# Altium schematic sheet SH3-FTDI.SchDoc: SH3_FTDI
size Letter; DrawnBy: Christopher Arjune; SheetNumber: 3; SheetTotal: 4
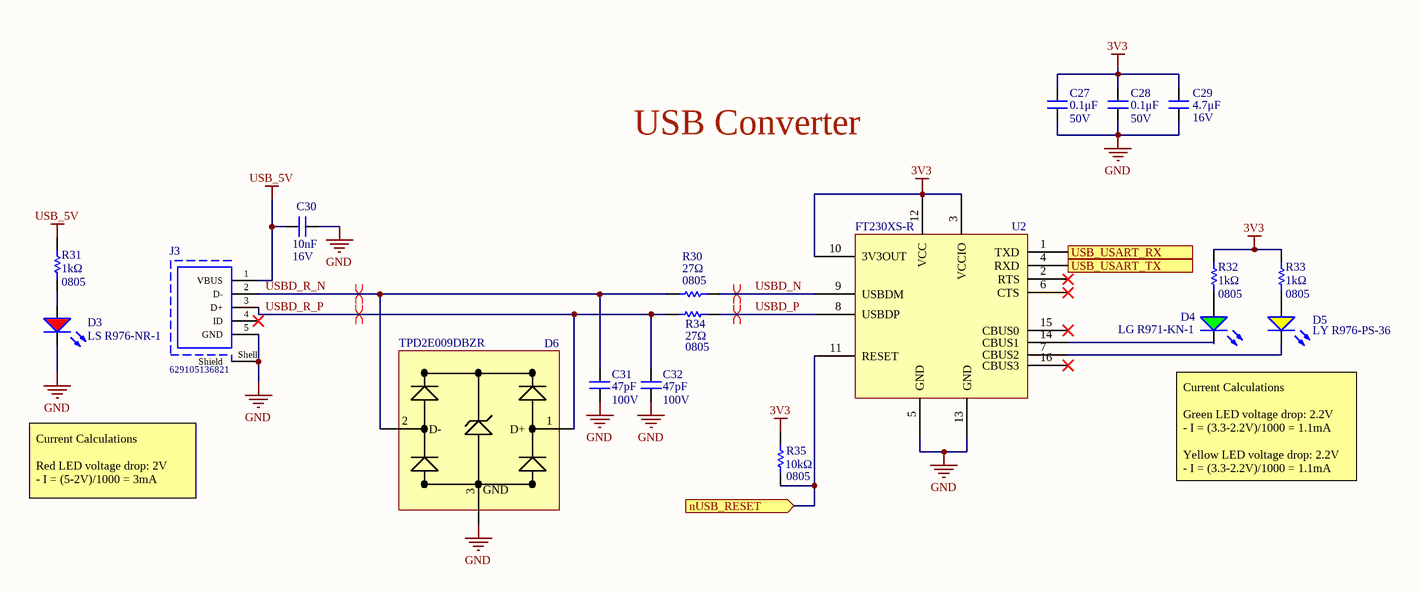
[diagram p0: SH3-FTDI.SchDoc]

## Parts
C27  0.1μF  Voltage Rating: 50V  [CAPC2012X140N]
C28  0.1μF  Voltage Rating: 50V  [CAPC2012X140N]
C29  value 4.7μF  Voltage Rating: 16V  [CAPC2012X140N]
C30  Capacitance: 10nF  Voltage Rating: 16V  [CAPC2012X140N]
C31  Capacitance: 47pF  Voltage Rating: 100V  [CAPC2012X140N]
C32  Capacitance: 47pF  Voltage Rating: 100V  [CAPC2012X140N]
D3  LS R976-NR-1  [LED_0805_LINE]
D4  LG R971-KN-1  [LED_0805_LINE]
D5  LY R976-PS-36  [LED_0805_LINE]
D6  Manufacturer Part Number: TPD2E009DBZR  [SOT23-3]  (hidden comment: TVS_DIODE_USB_5.5V)
J3  629105136821  [629105136821]
R30  Case/Package: 0805  Resistance: 27Ω  [RESC2012X60N]  (hidden comment: RES_27Ω_0805)
R31  1kΩ  Case Code (Imperial): 0805  [RESC2012X60N]
R32  1kΩ  Case Code (Imperial): 0805  [RESC2012X60N]
R33  1kΩ  Case Code (Imperial): 0805  [RESC2012X60N]
R34  Case/Package: 0805  Resistance: 27Ω  [RESC2012X60N]  (hidden comment: RES_27Ω_0805)
R35  value 10kΩ  Case Code (Imperial): 0805  [RESC2012X60N]  (hidden comment: RES_10kΩ_0805)
U2  Manufacturer Part Number 1: FT230XS-R  [SSOP16-0.635-5X4MM]  (hidden comment: IC_USB_TRANSCEIVER)

## Ports
nUSB_RESET (in), USB_USART_RX (out), USB_USART_TX (in)

## Nets
3V3: C27.2 C28.2 C29.2 R32.2 R33.2 R35.2 U2.3(VCCIO) U2.10(3V3OUT) U2.12(VCC)
GND: C27.1 C28.1 C29.1 C30.2 C31.2 C32.2 D3.2(K) D6.3(GND) J3.5(GND) J3.Shell(Shield) U2.5(GND) U2.13(GND)
USB_5V: C30.1 J3.1(VBUS) R31.2
nUSB_RESET: R35.1 U2.11(RESET) ; port nUSB_RESET
USB_USART_RX: U2.1(TXD) ; port USB_USART_RX
USB_USART_TX: U2.4(RXD) ; port USB_USART_TX
USBD_N: R30.2 U2.9(USBDM)
USBD_P: R34.2 U2.8(USBDP)
USBD_R_N: C31.1 D6.2(D-) J3.2(D-) R30.1
USBD_R_P: C32.1 D6.1(D+) J3.3(D+) R34.1
NetD3_1: D3.1(A) R31.1
NetD4_1: D4.1(A) R32.1
NetD4_2: D4.2(K) U2.14(CBUS1)
NetD5_1: D5.1(A) R33.1
NetD5_2: D5.2(K) U2.7(CBUS2)

Not connected (* = marked no-connect by the designer): J3 4(ID)*; U2 2(RTS)* 6(CTS)* 15(CBUS0)* 16(CBUS3)*

## Layout directives
differential pair: USBD_N, USBD_P, USBD_R_N, USBD_R_P

## Notes on the sheet
- USB Converter
- Current Calculations
  Red LED voltage drop: 2V
  - I = (5-2V)/1000 = 3mA
- Current Calculations
  Green LED voltage drop: 2.2V
  - I = (3.3-2.2V)/1000 = 1.1mA
  Yellow LED voltage drop: 2.2V
  - I = (3.3-2.2V)/1000 = 1.1mA
- Title
- Size:
- Date:
- Letter
- Drawn By:
- Sheet
- of
- File:

## Library data of the parts
C27 C28 = CAP_0.1uF_50V_0805: CAP CER 0.1UF 50V X7R 0805; Manufacturer 1: Murata Electronics; Manufacturer Part Number 1: GCD21BR71H104KA01L; Tolerance: 10%; Mount: Surface Mount; Case Code (Metric): 2012; Case Code (Imperial): 0805; Min Operating Temperature: -55°C; Max Operating Temperature: 125°C; Dielectric: X7R; Termination: SMD/SMT; Length: 2mm; Height: 1.25mm; Width: 0.049inch; Thickness: 0.049inch; Depth: 1.25mm; Ratings: AEC-Q200; Supplier 1: Digi-Key; Supplier Part Number 1: 490-11955-1-ND; Package: 0805 (2012 Metric); Value: 0.1μF
C29 = CAP_4.7uF_16V_0805: CAP CER 4.7UF 16V X5R 0805; Manufacturer 1: Samsung Electro-Mechanics; Manufacturer Part Number 1: CL21A475KOFNNNE; Tolerance: 10%; Mount: Surface Mount; Case Code (Metric): 2012; Case Code (Imperial): 0805; Min Operating Temperature: -55°C; Max Operating Temperature: 85°C; Dielectric: X5R; Termination: SMD/SMT; Supplier 1: Digi-Key; Supplier Part Number 1: 1276-1065-1-ND; Package: 0805 (2012 Metric)
C30 = CAP_10nF_16V_0805: CAP CER 10000PF 16V X7R 0805; Manufacturer 1: Yageo; Manufacturer Part Number 1: AC0805KRX7R7BB103; Tolerance: 10%; Supplier 1: Digi-Key; Stock 1: 14344; Pricing 1: 1=0.20000, 10=0.13900, 100=0.07060, 500=0.04832, 1000=0.04275 (USD); RoHS: No; Mount: Surface Mount; Case/Package: 0805; Case Code (Imperial): 0805; Case Code (Metric): 2012; Min Operating Temperature: -55°C; Max Operating Temperature: 125°C; Packaging: Cut Tape; Ratings: AEC-Q200; ComponentLink1URL: http://www.yageo.com/NewPortal/_en/search/productDocs.jsp?YageoPartNumber=AC0805KRX7R7BB103&src-supplier=Digi-Key; ComponentLink1Description: http://www.yageo.com/NewPortal/_en/search/productDocs.jsp?YageoPartNumber=AC0805KRX7R7BB103&src-supplier=Digi-Key; Supplier Part Number 1: 311-3161-1-ND
C31 C32 = CAP_47pF_100V_0805: CAP CER 47PF 100V NPO 0805; Manufacturer 1: Yageo; Manufacturer Part Number 1: AC0805JRNPO0BN470; Tolerance: 5%; Supplier 1: Digi-Key; Stock 1: 2091; Pricing 1: 1=0.19000, 10=0.12600, 100=0.06400, 500=0.04376, 1000=0.03871 (USD); RoHS: No; Mount: Surface Mount; Case/Package: 0805; Case Code (Imperial): 0805; Case Code (Metric): 2012; Min Operating Temperature: -55°C; Max Operating Temperature: 125°C; Packaging: Tape and Reel; Ratings: AEC-Q200; ComponentLink1URL: http://www.yageo.com/NewPortal/_en/search/productDocs.jsp?YageoPartNumber=AC0805JRNPO0BN470&src-supplier=Digi-Key; ComponentLink1Description: http://www.yageo.com/NewPortal/_en/search/productDocs.jsp?YageoPartNumber=AC0805JRNPO0BN470&src-supplier=Digi-Key; Supplier Part Number 1: 311-3131-1-ND
D3 = DIO_LED_R: LED RED DIFFUSED 0805 SMD; Manufacturer 1: OSRAM; Forward Voltage Drop: 2V; Package: 0805 (2012 Metric); Manufacturer Part Number 1: LS R976-NR-1; Supplier Part Number 1: 475-1278-1-ND; Supplier 1: Digi-Key; Mount: Surface Mount
D4 = DIO_LED_G: LED GREEN DIFFUSED 0805 SMD; Manufacturer 1: OSRAM; Forward Voltage Drop: 2.2V; Package: 0805 (2012 Metric); Manufacturer Part Number 1: LG R971-KN-1; Supplier Part Number 1: 475-1410-1-ND; Supplier 1: Digi-Key; Mount: Surface Mount
D5 = DIO_LED_Y: LED YELLOW DIFFUSED 0805 SMD; Manufacturer 1: OSRAM; Forward Voltage Drop: 2.2V; Package: 0805 (2012 Metric); Manufacturer Part Number 1: LY R976-PS-36; Supplier Part Number 1: 475-2560-1-ND; Supplier 1: Digi-Key; Mount: Surface Mount
D6 = TVS_DIODE_USB_5.5V: ESD Suppressor Diode Arrays 8KV 3-Pin SOT-23 T/R; Manufacturer: Texas Instruments; Direction: Unidirectional; Operating Supply Voltage: 6V; Capacitance: 0.9pF; Number of Channels: 2; Current Rating: 100nA; Peak Pulse Current: 1A; Element Configuration: Dual; Reverse Standoff Voltage: 5.5V; Min Breakdown Voltage: 9V; Clamping Voltage: 8V; Peak Pulse Power: 45W; Power Line Protection: Yes; Breakdown Voltage: 7V; Interface: LVDS,PCIe,SATA; Supplier 1: Digi-Key; RoHS: Yes; Category: Interface ICs; Stock 1: 98615; Pricing 1: 1=0.56000, 10=0.48000, 25=0.44800, 100=0.33280, 250=0.31616, 500=0.25984, 1000=0.21120 (USD); Case/Package: SOT-23; Number of Pins: 3; Min Operating Temperature: -40°C; Max Operating Temperature: 85°C; Packaging: Tape and Reel; Package Quantity: 1; Number of Bidirectional Channels: 2; Termination: SMD/SMT; Max Power Dissipation: 45W; Working Voltage: 5.5V; Length: 2.92mm; Height: 1mm; Width: 1.3mm; Depth: 1.3mm; Radiation Hardening: No; REACH SVHC: No SVHC; Lead Free: Lead Free; ComponentLink1URL: https://datasheet.ciiva.com/353/tpd2e009-353266.pdf?src-supplier=Digi-Key; ComponentLink1Description: https://datasheet.ciiva.com/353/tpd2e009-353266.pdf?src-supplier=Digi-Key; ComponentLink2URL: https://datasheet.ciiva.com/15134/getdatasheetpartid-243395-15134537.pdf?src-supplier=Verical; ComponentLink2Description: https://datasheet.ciiva.com/15134/getdatasheetpartid-243395-15134537.pdf?src-supplier=Verical; ComponentLink3URL: https://datasheet.ciiva.com/4479/slvs953a-121037-4479453.pdf?src-supplier=Mouser; ComponentLink3Description: https://datasheet.ciiva.com/4479/slvs953a-121037-4479453.pdf?src-supplier=Mouser; ComponentLink4URL: https://datasheet.ciiva.com/353/tpd2e009-353268.pdf?src-supplier=Digi-Key; ComponentLink4Description: https://datasheet.ciiva.com/353/tpd2e009-353268.pdf?src-supplier=Digi-Key; ComponentLink5URL: https://datasheet.ciiva.com/353/tpd2e009-353267.pdf?src-supplier=Digi-Key; ComponentLink5Description: https://datasheet.ciiva.com/353/tpd2e009-353267.pdf?src-supplier=Digi-Key; ComponentLink6URL: https://datasheet.ciiva.com/46384/1707898-46384524.pdf?src-supplier=Element14; ComponentLink6Description: https://datasheet.ciiva.com/46384/1707898-46384524.pdf?src-supplier=Element14; Supplier Part Number 1: 296-24657-1-ND
J3 = CMP-1502-03253-1: Micro USB 2.0 Type B Receptacle WR-COM, Horizontal, SMT, with Pads and Pegs; Manufacturer: Wurth Elektronik; Contact Resistance: 30mOhm; Rated Current: 1A; Working Voltage: 30VAC; Datasheet URL: https://katalog.we-online.de/em/datasheet/629105136821.pdf; Mounting Technology: SMT; Publisher: WurthElektronik; Package Reference: 629105136821; Orientation: Horizontal; Packaging: TapeandReel; Part Number: 629105136821; Manufacturer URL: http://www.we-online.de; Connector Type: MicroUSB2.0TypeB; Gender: Receptacle; Operating Temperature: -40to105degC
R30 R34 = RES_27Ω_0805: RES SMD 27 OHM 1% 1/8W 0805; Manufacturer 1: Yageo; Manufacturer Part Number 1: RC0805FR-0727RL; Temperature Coefficient: 100ppm/°C; Working Voltage: 150V; Power Rating: 125mW; Supplier 1: Digi-Key; Stock 1: 345388; Pricing 1: 1=0.10000, 10=0.04000, 100=0.01630, 1000=0.00731, 2500=0.00635 (USD); RoHS: Yes; Case Code (Imperial): 0805; Case Code (Metric): 2012; Min Operating Temperature: -55°C; Max Operating Temperature: 155°C; Tolerance: 1%; Composition: Thick Film; Packaging: Tape and Reel; Number of Terminations: 2; Termination: SMD/SMT; Voltage Rating: 150V; Military Standard: Not; Length: 2mm; Height: 0.5mm; Width: 1.25mm; Depth: 1.25mm; REACH SVHC: Unknown; Lead Free: Lead Free; ComponentLink1URL: https://datasheet.ciiva.com/12561/rc0805-257173-12561222.pdf?src-supplier=Mouser; ComponentLink1Description: https://datasheet.ciiva.com/12561/rc0805-257173-12561222.pdf?src-supplier=Mouser; ComponentLink2URL: https://datasheet.ciiva.com/7941/444164-7941752.pdf?src-supplier=Element14; ComponentLink2Description: https://datasheet.ciiva.com/7941/444164-7941752.pdf?src-supplier=Element14; ComponentLink3URL: https://datasheet.ciiva.com/7941/444164-7941753.pdf?src-supplier=Element14; ComponentLink3Description: https://datasheet.ciiva.com/7941/444164-7941753.pdf?src-supplier=Element14; Supplier Part Number 1: 311-27.0CRCT-ND
R31-R33 = RES_1kΩ_0805: RES SMD 1K OHM 1% 1/8W 0805; Manufacturer 1: Yageo; Manufacturer Part Number 1: RC0805FR-071KL; Power Rating: 125mW; Temperature Coefficient: 25ppm/°C; Voltage Rating: 150V; Supplier 1: Digi-Key; Case Code (Metric): 2012; Min Operating Temperature: -55°C; Max Operating Temperature: 155°C; Resistance: 1K; Tolerance: 1%; Termination: SMD/SMT; Supplier Part Number 1: 311-1.00KCRCT-ND; Package: 0805 (2012 Metric); Value: 1kΩ; RoHS: Yes; Mount: Surface Mount; Case/Package: 0805; Number of Pins: 2; Weight: 0.000194oz; Contact Plating: Tin; Packaging: Tape and Reel; Composition: Thin Film; Number of Terminations: 2; Voltage Rating (DC): 150V; Max Power Dissipation: 125mW; Package Quantity: 1000; Features: Moisture Resistant,Automotive AEC-Q200,Anti-Sulfur; Military Standard: Not; Length: 2mm; Height: 0.022inch; Width: 0.049inch; Depth: 1.25mm; Radiation Hardening: No; Lead Free: Lead Free; REACH SVHC: Unknown; ComponentLink1URL: https://datasheet.ciiva.com/9003/tnpw-e3-9003481.pdf?src-supplier=Avnet; ComponentLink1Description: https://datasheet.ciiva.com/9003/tnpw-e3-9003481.pdf?src-supplier=Avnet; ComponentLink2URL: https://datasheet.ciiva.com/9003/tnpw-e3-9003543.pdf?src-supplier=Avnet; ComponentLink2Description: https://datasheet.ciiva.com/9003/tnpw-e3-9003543.pdf?src-supplier=Avnet
R35 = RES_10kΩ_0805: RES SMD 10K OHM 1% 1/8W 0805; Manufacturer 1: Yageo; Manufacturer Part Number 1: RC0805FR-0710KL; Power Rating: 125mW; Supplier 1: Digi-Key; Case Code (Metric): 2012; Min Operating Temperature: -55°C; Max Operating Temperature: 155°C; Resistance: 10K; Tolerance: 1%; Termination: SMD/SMT; Supplier Part Number 1: 311-10.0KCRCT-ND; Package: 0805 (2012 Metric)
U2 = IC_USB_TRANSCEIVER: Manufacturer 1: FTDI, Future Technology Devices International Ltd; Supplier 1: Digi-Key; Supplier Part Number 1: 768-1135-1-ND